# EAGLE design M105 (EAGLE 6.6.0)
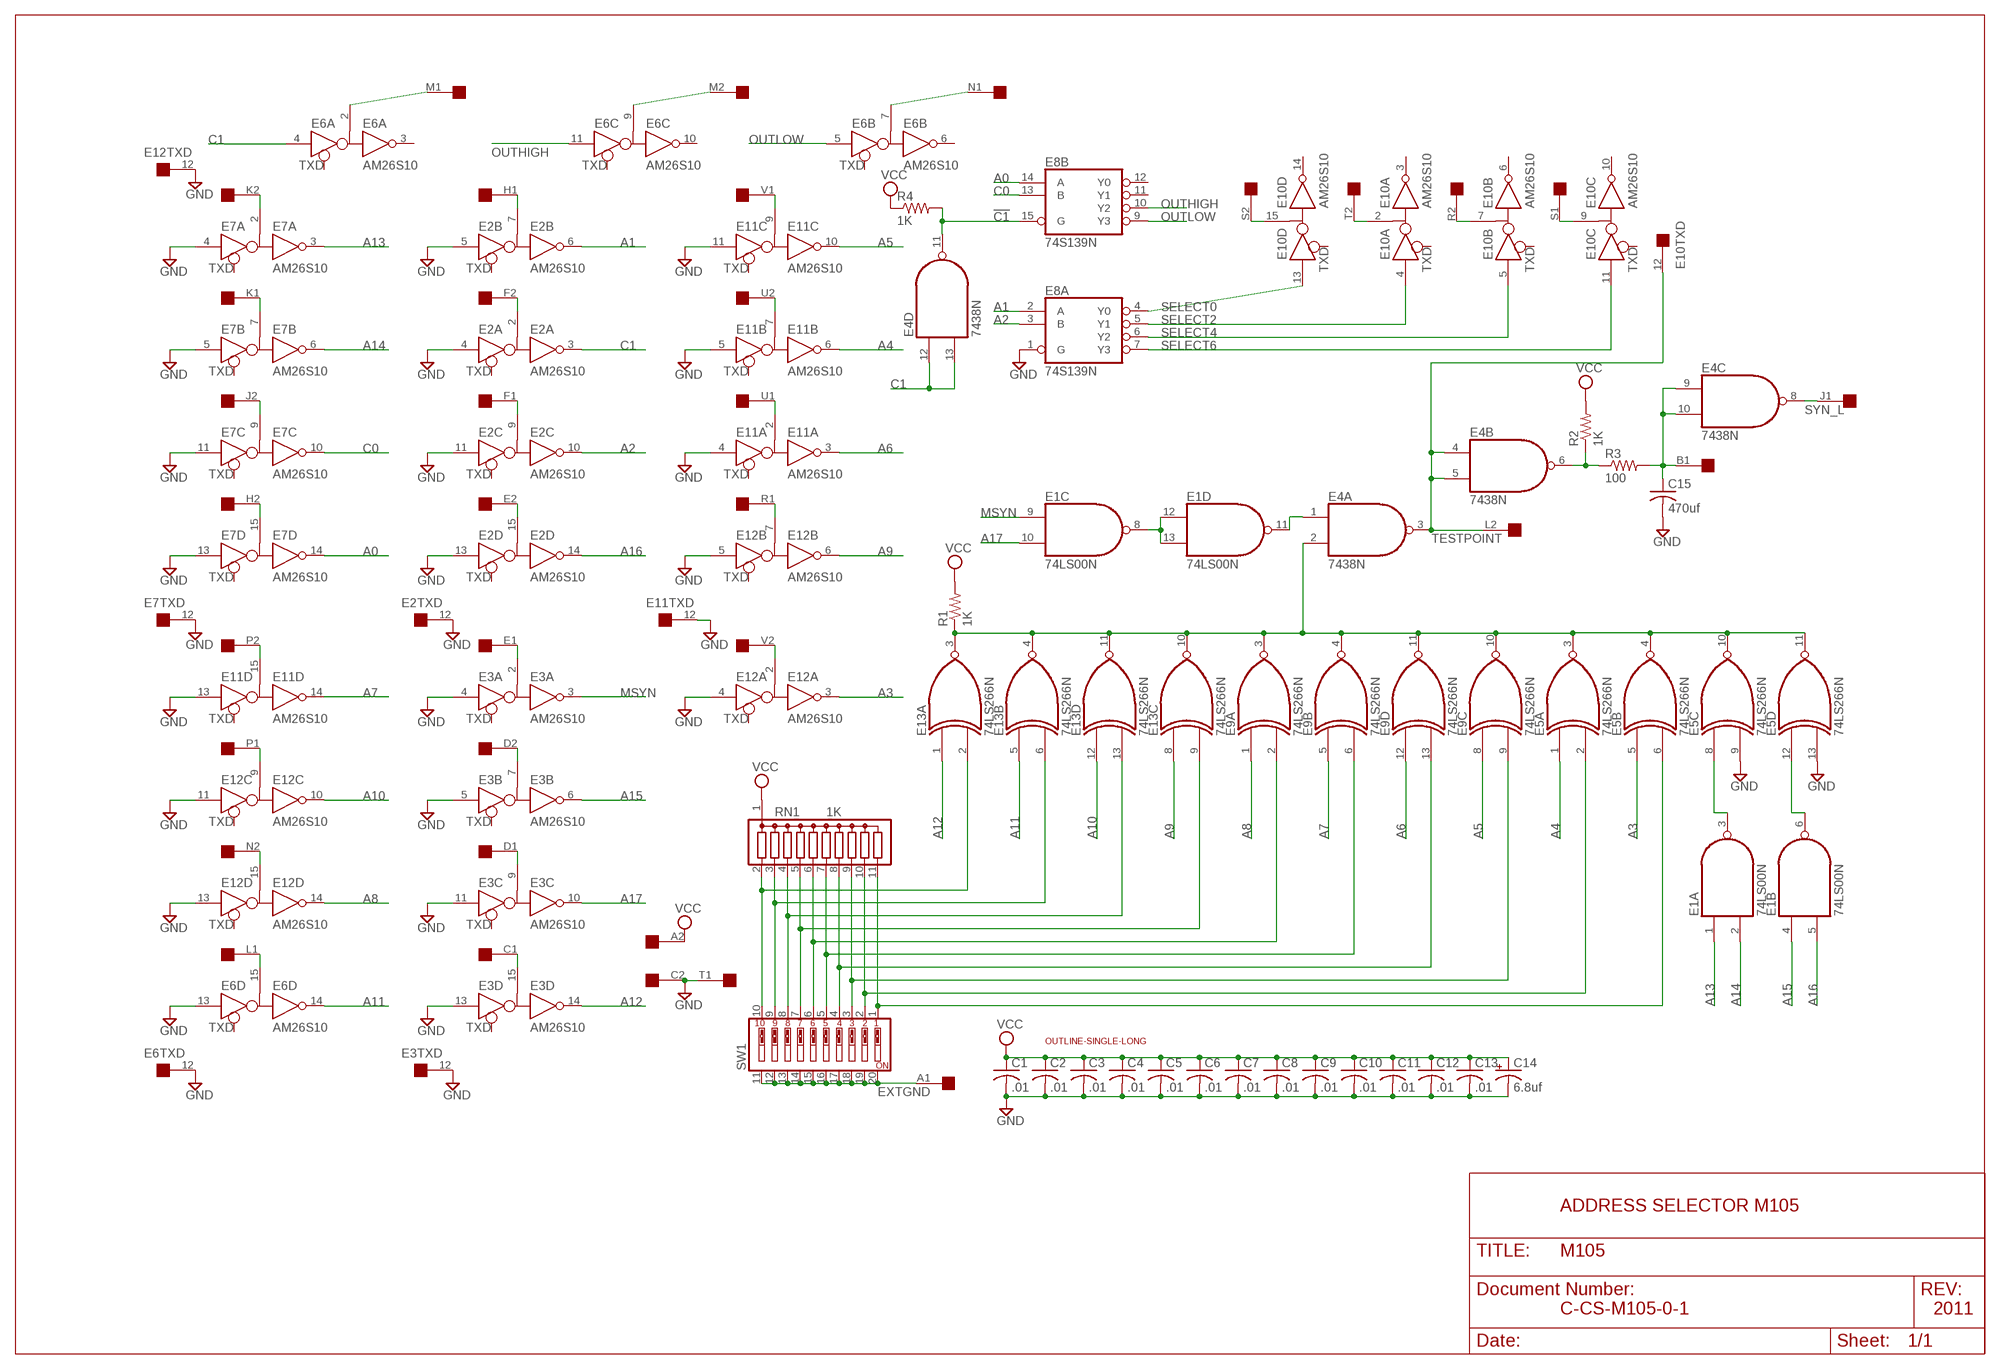
[diagram p0: schematic, sheet 1]

## Parts
C1  .01  C-US050-025X075  [C050-025X075]
C2  .01  C-US050-025X075  [C050-025X075]
C3  .01  C-US050-025X075  [C050-025X075]
C4  .01  C-US050-025X075  [C050-025X075]
C5  .01  C-US050-025X075  [C050-025X075]
C6  .01  C-US050-025X075  [C050-025X075]
C7  .01  C-US050-025X075  [C050-025X075]
C8  .01  C-US050-025X075  [C050-025X075]
C9  .01  C-US050-025X075  [C050-025X075]
C10  .01  C-US050-025X075  [C050-025X075]
C11  .01  C-US050-025X075  [C050-025X075]
C12  .01  C-US050-025X075  [C050-025X075]
C13  .01  C-US050-025X075  [C050-025X075]
C14  6.8uf  CPOL-USE15-5AXIAL  [E15-5]
C15  470uf  C-US050-025X075  [C050-025X075]
E1  74LS00N  [DIL14]
E2  AM26S10  [DIL16]
E3  AM26S10  [DIL16]
E4  7438N  [DIL14]
E5  74LS266N  [DIL14]
E6  AM26S10  [DIL16]
E7  AM26S10  [DIL16]
E8  74S139N  [DIL16]
E9  74LS266N  [DIL14]
E10  AM26S10  [DIL16]
E11  AM26S10  [DIL16]
E12  AM26S10  [DIL16]
E13  74LS266N  [DIL14]
R1  1K  R-US_0207/10  [0207/10]
R2  1K  R-US_0207/10  [0207/10]
R3  100  R-US_0207/10  [0207/10]
R4  1K  R-US_0207/10  [0207/10]
RN1  1K  G10R  [SIL11]
SW1  SW_DIP-10  [EDG-10]
U$1  SINGLE  [EDGE-CON2]
U$2  OUTLINE-SINGLE-LONG  [SINGLE-LONG]

## Nets
!C1: E4.11(D:O) E8.15(B:G) R4.2
A0: E7.14(D:R) E8.14(B:A)
A1: E2.6(B:R) E8.2(A:A)
A2: E2.10(C:R) E8.3(A:B)
A3: E5.5(B:I0) E12.3(A:R)
A4: E5.1(A:I0) E11.6(B:R)
A5: E9.8(C:I0) E11.10(C:R)
A6: E9.12(D:I0) E11.3(A:R)
A7: E9.5(B:I0) E11.14(D:R)
A8: E9.1(A:I0) E12.14(D:R)
A9: E12.6(B:R) E13.8(C:I0)
A10: E12.10(C:R) E13.12(D:I0)
A11: E6.14(D:R) E13.5(B:I0)
A12: E3.14(D:R) E13.1(A:I0)
A13: E1.1(A:I0) E7.3(A:R)
A14: E1.2(A:I1) E7.6(B:R)
A15: E1.4(B:I0) E3.6(B:R)
A16: E1.5(B:I1) E2.14(D:R)
A17: E1.10(C:I1) E3.10(C:R)
C0: E7.10(C:R) E8.13(B:B)
C1: E2.3(A:R) E4.12(D:I0) E4.13(D:I1) E6.4(A:D)
EXTGND: SW1.11 SW1.12 SW1.13 SW1.14 SW1.15 SW1.16 SW1.17 SW1.18 SW1.19 SW1.20 U$1.A1
GND [Supply]: C1.2 C2.2 C3.2 C4.2 C5.2 C6.2 C7.2 C8.2 C9.2 C10.2 C11.2 C12.2 C13.2 C14.- C15.2 E2.4(A:D) E2.5(B:D) E2.11(C:D) E2.12(TXD:TXD) E2.13(D:D) E3.4(A:D) E3.5(B:D) E3.11(C:D) E3.12(TXD:TXD) E3.13(D:D) E5.9(C:I1) E5.13(D:I1) E6.12(TXD:TXD) E6.13(D:D) E7.4(A:D) E7.5(B:D) E7.11(C:D) E7.12(TXD:TXD) E7.13(D:D) E8.1(A:G) E11.4(A:D) E11.5(B:D) E11.11(C:D) E11.12(TXD:TXD) E11.13(D:D) E12.4(A:D) E12.5(B:D) E12.11(C:D) E12.12(TXD:TXD) E12.13(D:D) U$1.C2 U$1.T1
MSYN: E1.9(C:I0) E3.3(A:R)
N$1: E3.2(A:B) U$1.E1
N$2: E3.7(B:B) U$1.D2
N$3: E3.9(C:B) U$1.D1
N$4: E3.15(D:B) U$1.C1
N$5: E2.7(B:B) U$1.H1
N$6: E2.2(A:B) U$1.F2
N$7: E2.9(C:B) U$1.F1
N$8: E2.15(D:B) U$1.E2
N$9: E7.2(A:B) U$1.K2
N$10: E7.7(B:B) U$1.K1
N$11: E7.9(C:B) U$1.J2
N$12: E7.15(D:B) U$1.H2
N$13: E11.15(D:B) U$1.P2
N$14: E12.9(C:B) U$1.P1
N$15: E12.15(D:B) U$1.N2
N$16: E6.15(D:B) U$1.L1
N$17: E12.7(B:B) U$1.R1
N$18: E12.2(A:B) U$1.V2
N$19: E11.2(A:B) U$1.U1
N$20: E11.7(B:B) U$1.U2
N$21: E11.9(C:B) U$1.V1
N$22: E4.6(B:O) R2.1 R3.1
N$23: E10.15(D:B) U$1.S2
N$24: E10.2(A:B) U$1.T2
N$25: E10.7(B:B) U$1.R2
N$26: E10.9(C:B) U$1.S1
N$27: E6.2(A:B) U$1.M1
N$28: E6.9(C:B) U$1.M2
N$29: E1.3(A:O) E5.8(C:I0)
N$30: E1.6(B:O) E5.12(D:I0)
N$31: E1.8(C:O) E1.12(D:I0) E1.13(D:I1)
N$33: E5.6(B:I1) RN1.11 SW1.1
N$34: E5.2(A:I1) RN1.10 SW1.2
N$35: E9.9(C:I1) RN1.9 SW1.3
N$36: E9.13(D:I1) RN1.8 SW1.4
N$37: E9.6(B:I1) RN1.7 SW1.5
N$38: E9.2(A:I1) RN1.6 SW1.6
N$39: E13.9(C:I1) RN1.5 SW1.7
N$40: E13.13(D:I1) RN1.4 SW1.8
N$41: E13.6(B:I1) RN1.3 SW1.9
N$42: E13.2(A:I1) RN1.2 SW1.10
N$43: E4.2(A:I1) E5.3(A:O) E5.4(B:O) E5.10(C:O) E5.11(D:O) E9.3(A:O) E9.4(B:O) E9.10(C:O) E9.11(D:O) E13.3(A:O) E13.4(B:O) E13.10(C:O) E13.11(D:O) R1.1
N$44: C15.1 E4.9(C:I0) E4.10(C:I1) R3.2 U$1.B1
N$45: E6.7(B:B) U$1.N1
N$46: E1.11(D:O) E4.1(A:I0)
OUTHIGH: E6.11(C:D) E8.10(B:Y2)
OUTLOW: E6.5(B:D) E8.9(B:Y3)
SELECT0: E8.4(A:Y0) E10.13(D:D)
SELECT2: E8.5(A:Y1) E10.4(A:D)
SELECT4: E8.6(A:Y2) E10.5(B:D)
SELECT6: E8.7(A:Y3) E10.11(C:D)
SYN_L: E4.8(C:O) U$1.J1
TESTPOINT: E4.3(A:O) E4.4(B:I0) E4.5(B:I1) E10.12(TXD:TXD) U$1.L2
VCC [Supply]: C1.1 C2.1 C3.1 C4.1 C5.1 C6.1 C7.1 C8.1 C9.1 C10.1 C11.1 C12.1 C13.1 C14.+ R1.2 R2.2 R4.1 RN1.1 U$1.A2
Unconnected: E6.3(A:R) E6.6(B:R) E6.10(C:R) E8.11(B:Y1) E8.12(B:Y0) E10.3(A:R) E10.6(B:R) E10.10(C:R) E10.14(D:R) U$1.B2

## Notes on the sheet
- ADDRESS SELECTOR M105
- C-CS-M105-0-1 | 2011

## Power pins joined to a net without a drawn wire
GND: E1.7(P:GND) E2.1(GND:GND) E2.8(PWR:GND) E3.1(GND:GND) E3.8(PWR:GND) E4.7(P:GND) E5.7(P:GND) E6.1(GND:GND) E6.8(PWR:GND) E7.1(GND:GND) E7.8(PWR:GND) E8.8(P:GND) E9.7(P:GND) E10.1(GND:GND) E10.8(PWR:GND) E11.1(GND:GND) E11.8(PWR:GND) E12.1(GND:GND) E12.8(PWR:GND) E13.7(P:GND)
VCC: E1.14(P:VCC) E2.16(PWR:VCC) E3.16(PWR:VCC) E4.14(P:VCC) E5.14(P:VCC) E6.16(PWR:VCC) E7.16(PWR:VCC) E8.16(P:VCC) E9.14(P:VCC) E10.16(PWR:VCC) E11.16(PWR:VCC) E12.16(PWR:VCC) E13.14(P:VCC)

## Library data of the parts
C1-C13 C15 = rcl:C-US: CAPACITOR, American symbol
C14 = rcl:CPOL-US: POLARIZED CAPACITOR, American symbol
E1 = 74xx-us:74*00: Quad 2-input NAND gate
E2 E3 E6 E7 E10-E12 = dec-con:AM26S10: Bus Transceiver
E4 = dec-con:74*38: Quad 2-input NAND gate, open collector output
E5 E9 E13 = 74xx-us:74*266: Quadruple EXCLUSIVE-NOR (XNOR), open-collector
E8 = 74xx-us:74*139: Dual 2-line to 4-line DECODER/DEMULTIPLEXER
R1-R4 = rcl:R-US_: RESISTOR, American symbol
RN1 = resistor-sil:G10R: SIL RESISTOR; OC_FARNELL: unknown; OC_NEWARK: unknown
SW1 = special:SW_DIP-10: DIP SWITCH
U$1 = dec-con:SINGLE: Single-Height DEC board
U$2 = dec-con:OUTLINE-*: Board outlines for DEC boards.

## Net classes
1 Supply: width 0.813 mm

## Board
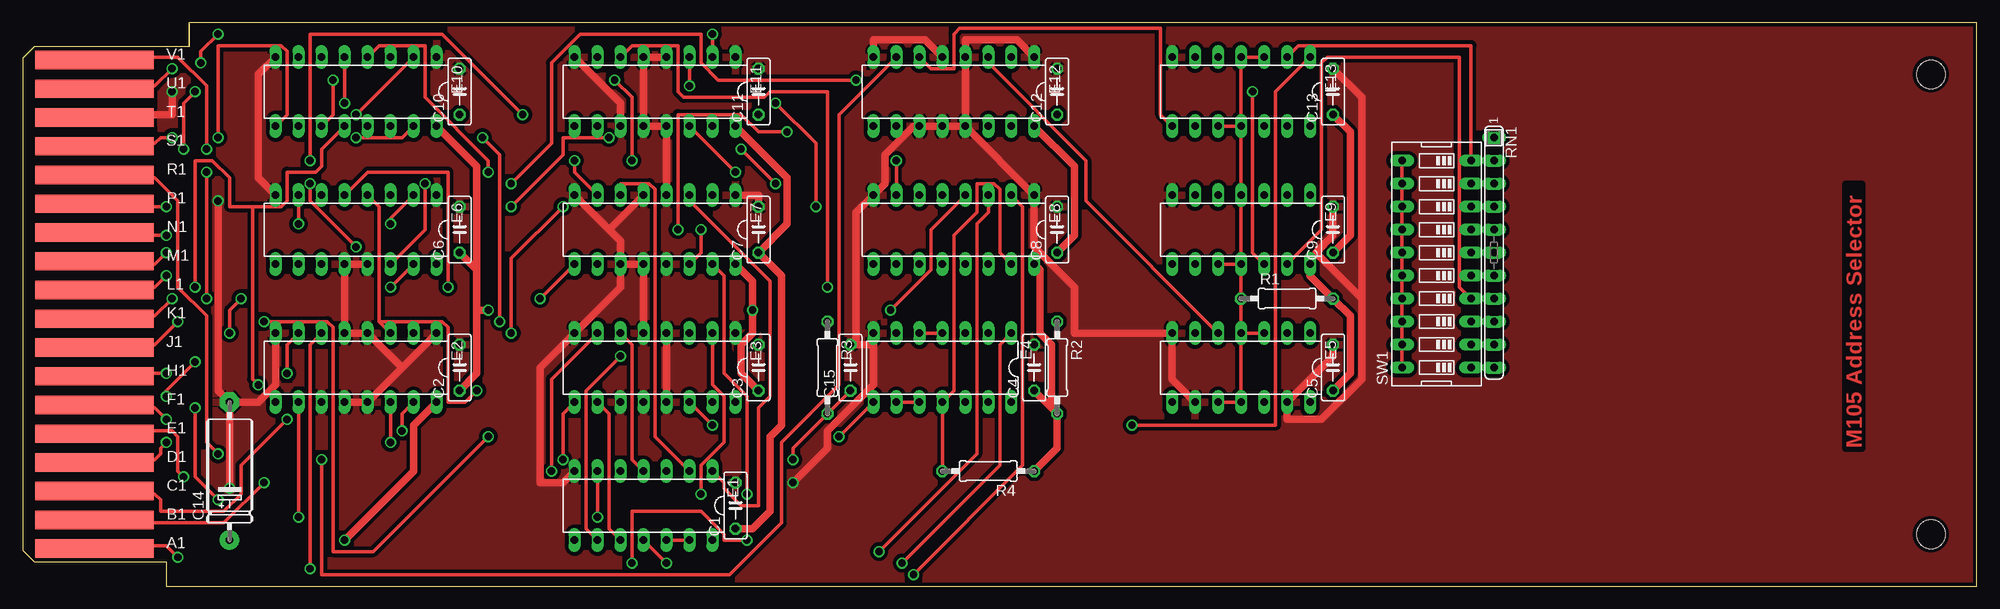
[diagram p1: board, top side]
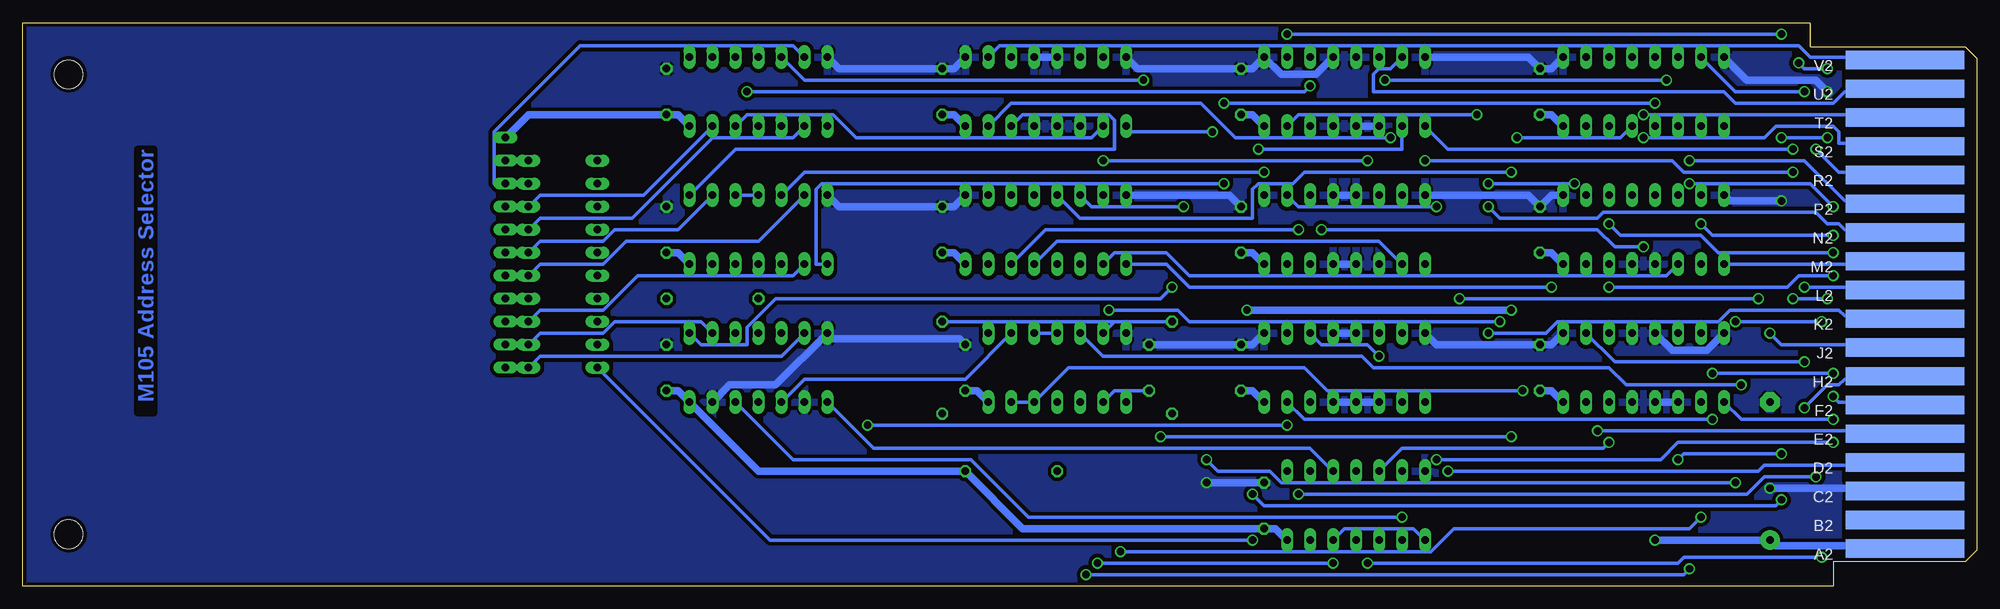
[diagram p2: board, bottom side, seen from below]

Size 215.9 x 62.23 mm. Coordinates in mm from the lower left corner, seen from the top.
Copper layers (1+16): Top 0.035mm / dielectric 1.5mm / Bottom 0.035mm
Design rules "16mils": minimum track width 16mil, minimum drill 32mil, track to track 15mil, track to pad 10mil, pad to pad 10mil, via to via 10mil, smd to smd 10mil, copper to edge 13mil, drill to drill 10mil, minimum pad ring 10mil, minimum via ring 8mil, stop-mask expansion 0mil, vias tented up to drill 0mil, thermal gap 10mil

### Footprints (pad centres in the part's own frame; a part is rotated, then mirrored left to right if it is on the bottom)
C050-025X075 = drill 0.813 octagon: 1 -2.54,0; 2 2.54,0
E15-5 = drill 0.813 pad 2.159: + -7.62,0 | drill 0.813 pad 2.159 octagon: - 7.62,0
DIL14 = drill 0.813 long: 1 -7.62,-3.81; 2 -5.08,-3.81; 3 -2.54,-3.81; 4 0,-3.81; 5 2.54,-3.81; 6 5.08,-3.81; 7 7.62,-3.81; 8 7.62,3.81; 9 5.08,3.81; 10 2.54,3.81; 11 0,3.81; 12 -2.54,3.81; 13 -5.08,3.81; 14 -7.62,3.81
DIL16 = drill 0.813 long: 1 -8.89,-3.81; 2 -6.35,-3.81; 3 -3.81,-3.81; 4 -1.27,-3.81; 5 1.27,-3.81; 6 3.81,-3.81; 7 6.35,-3.81; 8 8.89,-3.81; 9 8.89,3.81; 10 6.35,3.81; 11 3.81,3.81; 12 1.27,3.81; 13 -1.27,3.81; 14 -3.81,3.81; 15 -6.35,3.81; 16 -8.89,3.81
0207/10 = drill 0.813 octagon: 1 -5.08,0; 2 5.08,0
SIL11 = drill 0.813 long: 1 -12.7,0; 2 -10.16,0; 3 -7.62,0; 4 -5.08,0; 5 -2.54,0; 6 0,0; 7 2.54,0; 8 5.08,0; 9 7.62,0; 10 10.16,0; 11 12.7,0
EDG-10 = drill 0.813 long: 1 -11.43,-3.81; 2 -8.89,-3.81; 3 -6.35,-3.81; 4 -3.81,-3.81; 5 -1.27,-3.81; 6 1.27,-3.81; 7 3.81,-3.81; 8 6.35,-3.81; 9 8.89,-3.81; 10 11.43,-3.81; 11 11.43,3.81; 12 8.89,3.81; 13 6.35,3.81; 14 3.81,3.81; 15 1.27,3.81; 16 -1.27,3.81; 17 -3.81,3.81; 18 -6.35,3.81; 19 -8.89,3.81; 20 -11.43,3.81
EDGE-CON2 = smd 13.106 x 2.032: A1 7.938,4.128; B1 7.938,7.303; C1 7.938,10.477; D1 7.938,13.652; E1 7.938,16.828; F1 7.938,20.003; H1 7.938,23.177; J1 7.938,26.352; K1 7.938,29.527; L1 7.938,32.703; M1 7.938,35.877; N1 7.938,39.053; P1 7.938,42.227; R1 7.938,45.403; S1 7.938,48.578; T1 7.938,51.752; U1 7.938,54.928; V1 7.938,58.102 | smd 13.106 x 2.032 bottom: A2 7.938,4.128; B2 7.938,7.303; C2 7.938,10.477; D2 7.938,13.652; E2 7.938,16.828; F2 7.938,20.003; H2 7.938,23.177; J2 7.938,26.352; K2 7.938,29.527; L2 7.938,32.703; M2 7.938,35.877; N2 7.938,39.053; P2 7.938,42.227; R2 7.938,45.403; S2 7.938,48.578; T2 7.938,51.752; U2 7.938,54.928; V2 7.938,58.102
SINGLE-LONG = hole 3.175: 210.82,56.515; 210.82,5.715

### Placement (x,y rotation side)
C1  78.74,8.89 90 top
C2  48.26,24.13 90 top
C3  81.28,24.13 90 top
C4  111.76,24.13 90 top
C5  144.78,24.13 90 top
C6  48.26,39.37 90 top
C7  81.28,39.37 90 top
C8  114.3,39.37 90 top
C9  144.78,39.37 90 top
C10  48.26,54.61 90 top
C11  81.28,54.61 90 top
C12  114.3,54.61 90 top
C13  144.78,54.61 90 top
C14  22.86,12.7 90 top
C15  91.44,24.13 90 top
E1  68.58,8.89 180 top
E2  36.83,24.13 180 top
E3  69.85,24.13 180 top
E4  101.6,24.13 180 top
E5  134.62,24.13 180 top
E6  36.83,39.37 180 top
E7  69.85,39.37 180 top
E8  102.87,39.37 180 top
E9  134.62,39.37 180 top
E10  36.83,54.61 180 top
E11  69.85,54.61 180 top
E12  102.87,54.61 180 top
E13  134.62,54.61 180 top
R1  139.7,31.75 0 top
R2  114.3,24.13 270 top
R3  88.9,24.13 270 top
R4  106.68,12.7 180 top
RN1  162.56,36.83 270 top
SW1  156.21,35.56 90 top
U$1  0,0 0 top
U$2  0,0 0 top

### Tracks (layer width: path | path; a pad name or v marks a point on that pad's centre or on a via)
!C1
  Top 0.406: R4.2 E4.11 102.87,21.59 102.87,38.73 105.41,41.27 105.41,44.45 107.32,44.45 107.95,43.81 107.95,36.83 E8.15
A0  (via drill 0.81)
  Top 0.406: E7.14 74.93,36.83 v74.93,39.37
  Bottom 0.406: v74.93,39.37 102.87,39.37 E8.14
A1  (via drill 0.81)
  Top 0.406: E2.6 31.75,26.67 v31.75,1.91 | v98.43,1.27 110.49,13.34 110.49,41.91 E8.2
  Bottom 0.406: v31.75,1.91 32.39,1.27 v98.43,1.27
A2  (via drill 0.81)
  Top 0.406: v30.48,7.62 E2.10 | v94.62,3.81 105.41,14.61 105.41,40.01 106.68,41.27 E8.3
  Bottom 0.406: v30.48,7.62 31.75,6.35 57.79,6.35 60.33,3.81 v94.62,3.81
A3
  Top 0.406: E5.5 117.48,42.55 117.48,46.99 106.68,57.78 E12.3
A4  (via drill 0.81)
  Top 0.406: E11.6 67.31,59.69 72.39,59.69 72.39,54.61 73.03,53.98 81.92,53.98 82.55,54.61 88.9,54.61 v88.9,33.02
  Bottom 0.406: v88.9,33.02 90.17,31.75 132.72,31.75 135.89,28.57 135.89,26.67 140.97,26.67 E5.1
A5  (via drill 0.81)
  Top 0.406: v83.19,44.45 v79.38,48.26
  Bottom 0.406: E11.10 63.5,48.26 v79.38,48.26 | v83.19,44.45 127.64,44.45 128.27,43.81 128.27,35.56 E9.8
A6  (via drill 0.81)
  Top 0.406: v73.66,55.24 E11.3 | v135.89,54.61 135.89,36.83 E9.12
  Bottom 0.406: v73.66,55.24 74.3,54.61 v135.89,54.61
A7  (via drill 0.81)
  Top 0.406: v78.74,45.72 E11.14
  Bottom 0.406: v78.74,45.72 129.54,45.72 E9.5
A8
  Bottom 0.406: E12.14 105.41,52.07 95.89,52.07 95.25,51.44 95.25,48.26 137.16,48.26 E9.1
A9
  Top 0.406: E12.6 100.33,57.15 102.87,57.15 102.87,60.96 103.51,61.59 125.73,61.59 125.73,52.07 E13.8
A10
  Bottom 0.406: E12.10 97.79,49.53 123.83,49.53 126.37,52.07 135.89,52.07 E13.12
A11  (via drill 0.81)
  Top 0.406: E6.14 44.45,39.37 v44.45,44.45 | v53.98,44.45 58.42,48.9 58.42,57.78 61.6,60.96 74.93,60.96 74.93,57.78 76.84,55.88 v92.08,55.88
  Bottom 0.406: v53.98,44.45 v44.45,44.45 | v92.08,55.88 129.54,55.88 E13.5
A12  (via drill 0.81)
  Top 0.406: v76.2,17.78 E3.14 | v122.56,17.78 138.43,17.78 138.43,54.61 E13.1
  Bottom 0.406: v122.56,17.78 v76.2,17.78
A13
  Top 0.406: E1.1 77.47,11.43 77.47,10.79 79.38,8.89 81.28,8.89 81.28,19.68 82.55,20.95 82.55,33.66 73.66,42.55 E7.3
A14
  Top 0.406: E1.2 69.85,16.51 69.85,43.81 69.22,44.45 66.04,44.45 E7.6
A15
  Top 0.406: E1.4 67.31,13.97 67.31,26.67 E3.6
A16  (via drill 0.81)
  Top 0.406: v40.64,15.88 E2.14
  Bottom 0.406: v40.64,15.88 41.28,15.24 63.5,15.24 E1.5
A17
  Top 0.406: E1.10 64.77,6.35 64.77,19.05 E3.10
C0
  Bottom 0.406: E7.10 66.04,38.1 101.6,38.1 E8.13
C1  (via drill 0.81)
  Top 0.406: 39.37,29.21 E2.3 | 39.37,29.21 39.37,41.91 E6.4 | v50.17,21.59 48.9,20.32 46.99,20.32 46.99,28.57 46.36,29.21 39.37,29.21
  Bottom 0.406: E4.13 E4.12 100.33,24.13 74.3,24.13 71.76,21.59 v50.17,21.59
EXTGND  (via drill 0.81)
  Top 0.406: SW1.11 SW1.12 SW1.13 SW1.14 SW1.15 SW1.16 SW1.17 SW1.18 SW1.19 SW1.20 | v80.01,5.08 77.47,5.08 77.47,5.71 74.93,8.26 67.31,8.26 v67.31,2.54 | v17.15,3.17 15.88,4.45 8.26,4.45 U$1.A1
  Bottom 0.406: SW1.20 133.35,5.08 v80.01,5.08 | v67.31,2.54 33.02,2.54 32.39,3.17 v17.15,3.17
GND  (via drill 0.81)
  Top 0.813: E2.12 E2.13 41.91,24.13 | 41.91,24.13 E2.1 | E6.8 26.04,45.09 26.04,56.52 E10.8 | E6.13 E6.12 E2.5 E2.4 41.91,24.13 | C14.- 26.04,20.32 27.94,22.23 E2.8 | v21.59,42.55 21.59,21.59 C14.- | C14.- v22.86,10.79 | v16.51,54.61 16.51,52.07 8.26,52.07 U$1.T1 | E5.9 127,22.86 E5.7 116.21,27.94 116.21,33.02 111.76,37.47 E8.1 E12.13 | C5.2 144.78,25.4 E5.13 139.7,18.41 143.51,18.41 147.96,22.86 147.96,31.75 | C9.2 144.78,38.73 142.88,36.83 147.96,31.75 | C13.2 147.96,53.98 147.96,31.75 | E1.7 59.69,11.43 57.15,11.43 57.15,24.13 E3.8 66.04,33.02 E7.11 | E7.11 E7.12 E3.5 | 64.77,39.37 66.04,38.1 E7.11 | 64.77,39.37 E7.8 | 64.77,39.37 E7.5 | E3.4 E3.13 | E7.1 81.28,43.18 C7.2 | v85.09,11.43 88.9,15.24 88.9,17.14 93.98,22.23 93.98,26.67 | E4.7 93.98,26.67 | 93.98,26.67 92.08,26.67 | 92.08,26.67 92.08,41.27 E8.8 95.25,44.45 95.25,47.62 98.43,50.8 E12.11 E12.12 E12.13 | 92.08,26.67 C15.2 | E12.13 E12.4 104.14,60.33 109.86,60.33 E12.1 | E11.4 E11.5 E11.12 E11.13 E7.4 | E11.8 66.04,53.34 E11.11 | E12.5 99.7,60.33 93.98,60.33 E12.8
  Bottom 0.813: E2.1 46.99,26.67 C2.2 59.69,26.67 E3.8 | E2.12 E2.11 | E2.8 29.85,26.04 33.66,26.04 E2.5 | E6.8 27.31,42.55 v21.59,42.55 | v22.86,10.79 8.26,10.79 U$1.C2 | v16.51,54.61 17.78,55.88 25.4,55.88 E10.8 | C4.2 112.4,27.3 126.37,27.3 E5.7 132.72,22.23 137.8,22.23 E5.13 | E3.11 E3.12 E3.13 | E6.1 46.99,43.18 C6.2 49.53,43.18 E7.8 | E7.4 E7.5 | E3.4 E3.5 | E7.12 E7.13 | E3.1 80.01,26.67 C3.2 C15.2 | v85.09,11.43 C1.2 | C7.2 82.55,43.18 E8.8 | E12.1 113.03,57.15 C12.2 125.73,57.15 E13.7 | E12.4 E12.5 | E8.1 113.03,41.91 C8.2 125.73,41.91 E9.7 | E12.8 92.71,57.15 C11.2 80.01,57.15 E11.1 76.84,56.52 73.03,56.52 E11.4 | E10.1 46.99,57.15 C10.2 49.53,58.42 E11.8 | E11.12 E11.11
  pour Bottom (isolate 0.406): 15.24,0 215.9,0 215.9,62.23 15.24,62.23
  pour Top (isolate 0.406): 15.24,0 215.9,0 215.9,62.23 15.24,62.23
MSYN  (via drill 0.81)
  Top 0.406: E1.9 62.23,6.35 62.23,21.59 v66.04,25.4
  Bottom 0.406: v66.04,25.4 67.31,26.67 72.39,26.67 E3.3
N$1  (via drill 0.81)
  Top 0.406: E3.2 76.2,22.23 77.47,20.95 77.47,15.88 74.93,13.34 v74.93,10.16 | v17.78,12.06 17.15,12.7 17.15,16.51 16.51,17.14 8.26,17.14 U$1.E1
  Bottom 0.406: v74.93,10.16 25.4,10.16 23.5,12.06 v17.78,12.06
N$2  (via drill 0.81)
  Top 0.406: E3.7 58.42,22.86 v58.42,12.7
  Bottom 0.406: v58.42,12.7 24.13,12.7 23.5,13.34 8.26,13.34 U$1.D2
N$3  (via drill 0.81)
  Top 0.406: E3.9 59.69,19.05 v59.69,13.97 | v15.88,15.88 15.24,15.24 15.24,14.61 14.61,13.97 8.26,13.97 U$1.D1
  Bottom 0.406: v59.69,13.97 34.93,13.97 33.02,15.88 v15.88,15.88
N$4  (via drill 0.81)
  Top 0.406: v29.21,18.41 24.13,13.34 24.13,10.16 22.23,8.26 15.24,8.26 15.24,9.53 14.61,10.16 8.26,10.16 U$1.C1
  Bottom 0.406: E3.15 74.3,18.41 v29.21,18.41
N$5  (via drill 0.81)
  Top 0.406: E2.7 29.21,26.67 v29.21,23.5 | v15.88,23.5 8.26,23.5 U$1.H1
  Bottom 0.406: v15.88,23.5 v29.21,23.5
N$6  (via drill 0.81)
  Top 0.406: v19.05,24.77 15.88,21.59 v15.88,20.95
  Bottom 0.406: E2.2 40.01,24.77 v19.05,24.77 | v15.88,20.95 15.24,20.32 8.26,20.32 U$1.F2
N$7  (via drill 0.81)
  Top 0.406: v15.88,18.41 14.61,19.68 8.26,19.68 U$1.F1
  Bottom 0.406: E2.9 26.04,18.41 v15.88,18.41
N$8  (via drill 0.81)
  Top 0.406: E2.15 41.91,19.05 v41.91,17.14
  Bottom 0.406: v41.91,17.14 8.26,17.14 U$1.E2
N$9  (via drill 0.81)
  Top 0.406: v59.69,41.91 53.98,36.2 v53.98,27.94
  Bottom 0.406: E7.2 74.93,41.91 v59.69,41.91 | v53.98,27.94 47.63,27.94 46.36,29.21 28.58,29.21 27.31,30.48 15.24,30.48 14.61,29.84 8.26,29.84 U$1.K2
N$10  (via drill 0.81)
  Top 0.406: E7.7 60.96,45.72 v60.96,46.99 | v20.32,31.75 v20.32,45.72 | v16.51,31.75 14.61,29.84 8.26,29.84 U$1.K1
  Bottom 0.406: v60.96,46.99 33.66,46.99 32.39,45.72 v20.32,45.72 | v16.51,31.75 v20.32,31.75
N$11  (via drill 0.81)
  Top 0.406: v57.15,31.75 E7.9 | v24.13,31.75 22.86,30.48 v22.86,27.94
  Bottom 0.406: v24.13,31.75 v57.15,31.75 | v22.86,27.94 21.59,26.67 8.26,26.67 U$1.J2
N$12  (via drill 0.81)
  Top 0.406: E7.15 77.47,34.29 77.47,23.5 80.01,20.95 v80.01,10.16 | v21.59,9.53 19.05,12.06 v19.05,19.68
  Bottom 0.406: v80.01,10.16 78.74,8.89 22.23,8.89 v21.59,9.53 | v19.05,19.68 16.51,22.23 15.24,22.23 14.61,22.86 8.26,22.86 U$1.H2
N$13  (via drill 0.81)
  Top 0.406: v55.25,52.07 46.36,60.96 31.75,60.96 v31.75,46.99
  Bottom 0.406: E11.15 74.93,52.07 v55.25,52.07 | v31.75,46.99 19.05,46.99 14.61,42.55 8.26,42.55 U$1.P2
N$14  (via drill 0.81)
  Top 0.406: v84.46,50.16 81.28,50.16 79.38,52.07 72.39,52.07 v72.39,39.37 | v36.83,37.47 31.75,42.55 v31.75,44.45 | v15.88,41.91 8.26,41.91 U$1.P1
  Bottom 0.406: E12.9 93.35,50.16 v84.46,50.16 | v72.39,39.37 41.91,39.37 40.01,37.47 v36.83,37.47 | v31.75,44.45 18.42,44.45 v15.88,41.91
N$15  (via drill 0.81)
  Top 0.406: v64.77,49.53 59.69,49.53 59.69,47.62 v53.98,41.91
  Bottom 0.406: E12.15 106.68,53.34 85.73,53.34 81.92,49.53 v64.77,49.53 | v53.98,41.91 52.71,40.64 41.91,40.64 41.28,41.27 17.78,41.27 16.51,40.01 15.24,40.01 14.61,39.37 8.26,39.37 U$1.N2
N$16  (via drill 0.81)
  Top 0.406: v40.64,33.02 E6.15 | v15.88,34.29 14.61,33.02 8.26,33.02 U$1.L1
  Bottom 0.406: v40.64,33.02 20.96,33.02 19.69,34.29 v15.88,34.29
N$17  (via drill 0.81)
  Top 0.406: E12.7 90.17,52.07 90.17,22.23 83.82,15.88 83.82,6.99 78.11,1.27 33.02,1.27 v33.02,13.97 | v21.59,14.61 20.32,15.88 20.32,29.84 17.15,33.02 17.15,42.55 14.61,45.09 8.26,45.09 U$1.R1
  Bottom 0.406: v33.02,13.97 32.39,14.61 v21.59,14.61
N$18
  Bottom 0.406: E12.2 107.95,59.69 19.69,59.69 18.42,58.42 8.26,58.42 U$1.V2
N$19  (via drill 0.81)
  Top 0.406: v76.2,60.96 E11.2 | v21.59,60.96 19.69,59.05 v19.69,57.78 | v16.51,57.15 14.61,55.24 8.26,55.24 U$1.U1
  Bottom 0.406: v21.59,60.96 v76.2,60.96 | v19.69,57.78 19.05,57.15 v16.51,57.15
N$20
  Bottom 0.406: E11.7 64.77,57.15 66.04,57.15 66.68,56.52 66.68,54.61 27.94,54.61 26.67,53.34 15.88,53.34 14.61,54.61 8.26,54.61 U$1.U2
N$21  (via drill 0.81)
  Top 0.406: v20.32,48.26 20.32,55.24 17.15,58.42 8.26,58.42 U$1.V1
  Bottom 0.406: E11.9 58.42,48.26 v20.32,48.26
N$22
  Bottom 0.406: 95.25,29.21 E4.6 | R3.1 95.25,29.21 | 95.25,29.21 R2.1
N$23  (via drill 0.81)
  Top 0.406: E10.15 41.91,49.53 v36.83,49.53
  Bottom 0.406: v36.83,49.53 23.5,49.53 22.23,50.8 15.88,50.8 15.24,50.16 15.24,48.9 8.26,48.9 U$1.S2
N$24  (via drill 0.81)
  Top 0.406: v36.83,52.07 E10.2
  Bottom 0.406: v36.83,52.07 8.26,52.07 U$1.T2
N$25  (via drill 0.81)
  Top 0.406: v19.05,54.61 17.78,53.34 v17.78,48.26
  Bottom 0.406: E10.7 26.67,54.61 v19.05,54.61 | v17.78,48.26 15.24,45.72 8.26,45.72 U$1.R2
N$26  (via drill 0.81)
  Top 0.406: E10.9 29.21,52.07 29.21,59.05 28.58,59.69 21.59,59.69 v21.59,49.53 | v16.51,49.53 15.24,49.53 14.61,48.9 8.26,48.9 U$1.S1
  Bottom 0.406: v16.51,49.53 v21.59,49.53
N$27  (via drill 0.81)
  Top 0.406: E6.2 40.64,40.64 v40.64,40.01 | v15.88,36.83 14.61,35.56 8.26,35.56 U$1.M1
  Bottom 0.406: v40.64,40.01 39.37,38.73 30.48,38.73 28.58,36.83 v15.88,36.83
N$28
  Bottom 0.406: E6.9 8.26,35.56 U$1.M2
N$29
  Bottom 0.406: E1.3 73.66,15.24 121.92,15.24 E5.8
N$30  (via drill 0.81)
  Top 0.406: v63.5,7.62 E1.6
  Bottom 0.406: v63.5,7.62 104.78,7.62 111.13,13.97 130.81,13.97 E5.12
N$31
  Top 0.406: E1.12 E1.13
  Bottom 0.406: E1.8 62.23,6.35 69.85,6.35 E1.12
N$33
  Top 0.406: RN1.11 SW1.1
  Bottom 0.406: E5.6 132.08,25.4 158.75,25.4 SW1.1
N$34
  Top 0.406: RN1.10 SW1.2
  Bottom 0.406: E5.2 140.97,29.21 150.5,29.21 151.77,27.94 158.75,27.94 SW1.2
N$35
  Top 0.406: RN1.9 SW1.3
  Bottom 0.406: E9.9 130.81,34.29 147.96,34.29 151.77,30.48 158.75,30.48 SW1.3
N$36
  Top 0.406: RN1.8 SW1.4 158.75,33.02 158.75,58.42 144.15,58.42 143.51,57.78 143.51,39.37 E9.13
N$37
  Top 0.406: RN1.7 SW1.5
  Bottom 0.406: E9.6 134.62,38.1 149.23,38.1 151.77,35.56 158.75,35.56 SW1.5
N$38
  Top 0.406: RN1.6 SW1.6
  Bottom 0.406: E9.2 143.51,39.37 150.5,39.37 151.77,38.1 158.75,38.1 SW1.6
N$39
  Top 0.406: RN1.5 SW1.7
  Bottom 0.406: E13.9 130.81,49.53 139.7,49.53 148.59,40.64 158.75,40.64 SW1.7
N$40
  Top 0.406: RN1.4 SW1.8
  Bottom 0.406: E13.13 147.32,43.18 158.75,43.18 SW1.8
N$41
  Top 0.406: RN1.3 SW1.9
  Bottom 0.406: E13.6 130.81,59.69 154.31,59.69 163.83,50.16 163.83,44.45 RN1.3
N$42
  Top 0.406: RN1.2 SW1.10 160.02,59.69 140.97,59.69 E13.2
N$43
  Top 0.406: E13.11 E13.10 | E13.3 E13.4 E13.11 | E13.11 E9.4 E9.11 | E5.3 E5.4 | E9.11 E9.10 | E9.11 R1.1 E5.4 | E5.10 E5.11 E5.4
  Bottom 0.406: E9.3 E9.4 | E4.2 111.76,22.86 129.54,22.86 E5.10
N$44  (via drill 0.81)
  Top 0.406: E4.10 E4.9 | C15.1 R3.2 85.09,15.24 v85.09,13.97 | v26.67,11.43 22.23,6.99 8.26,6.99 U$1.B1
  Bottom 0.406: E4.9 95.25,21.59 C15.1 | v85.09,13.97 83.82,12.7 78.11,12.7 76.84,11.43 v26.67,11.43
N$45  (via drill 0.81)
  Top 0.406: v30.48,40.01 E6.7 | v15.88,38.73 8.26,38.73 U$1.N1
  Bottom 0.406: v30.48,40.01 29.21,38.73 v15.88,38.73
N$46  (via drill 0.81)
  Top 0.406: v71.12,2.54 E1.11 | v97.16,2.54 107.95,13.34 107.95,26.67 E4.1
  Bottom 0.406: v97.16,2.54 v71.12,2.54
OUTHIGH
  Bottom 0.406: E6.11 34.29,34.29 87,34.29 89.54,36.83 95.25,36.83 E8.10
OUTLOW  (via drill 0.81)
  Top 0.406: E6.5 38.1,45.72 46.99,45.72 v46.99,33.02
  Bottom 0.406: v46.99,33.02 87,33.02 89.54,35.56 E8.9
SELECT0  (via drill 0.81)
  Top 0.406: v50.8,49.53 52.71,47.62 v52.71,29.21 | v95.89,30.48 100.33,34.92 100.33,39.37 E8.4
  Bottom 0.406: E10.13 39.37,49.53 v50.8,49.53 | v52.71,29.21 87,29.21 88.27,30.48 v95.89,30.48
SELECT2  (via drill 0.81)
  Top 0.406: E10.4 39.37,59.69 44.45,59.69 44.45,53.98 51.44,46.99 v51.44,45.72
  Bottom 0.406: v51.44,45.72 74.3,45.72 75.57,44.45 79.38,44.45 80.01,43.81 80.01,40.64 99.06,40.64 E8.5
SELECT4  (via drill 0.81)
  Top 0.406: v35.56,53.34 E10.5 | v83.19,53.34 87.63,48.9 v87.63,41.91
  Bottom 0.406: v83.19,53.34 v35.56,53.34 | v87.63,41.91 97.79,41.91 E8.6
SELECT6  (via drill 0.81)
  Top 0.406: E10.11 34.29,52.07 v34.29,55.88 | v65.41,55.88 67.31,53.98 v67.31,46.99 | E8.7 v96.52,46.99
  Bottom 0.406: v65.41,55.88 v34.29,55.88 | v96.52,46.99 v67.31,46.99
SYN_L  (via drill 0.81)
  Top 0.406: v90.17,16.51 E4.8 | v51.44,16.51 38.74,3.81 34.29,3.81 34.29,28.57 33.66,29.21 v26.67,29.21 | v17.15,29.21 14.61,26.67 8.26,26.67 U$1.J1
  Bottom 0.406: v51.44,16.51 v90.17,16.51 | v17.15,29.21 v26.67,29.21
TESTPOINT  (via drill 0.81)
  Top 0.406: E4.4 E4.5 | E10.12 33.02,48.26 33.02,46.35 32.39,45.72 29.21,45.72 29.21,42.55 28.58,41.91 25.4,41.91 | 25.4,41.91 22.86,41.91 22.86,45.09 20.96,46.99 19.05,46.99 v19.05,33.02 | v26.04,22.23 25.4,22.86 25.4,41.91
  Bottom 0.406: E4.4 E4.3 | v19.05,33.02 8.26,33.02 U$1.L2 | E4.5 96.52,25.4 67.95,25.4 66.68,24.13 40.64,24.13 38.74,22.23 v26.04,22.23
VCC  (via drill 0.81)
  Top 0.813: C2.1 50.17,23.5 50.17,30.48 | 50.17,34.92 50.17,30.48 | C6.1 50.17,34.92 | E10.16 50.17,46.35 50.17,34.92 | E2.16 43.18,17.78 43.18,12.7 v35.56,5.08 | E9.14 142.24,34.29 R1.2 146.69,29.84 146.69,23.5 C5.1 | C9.1 146.69,38.73 146.69,50.16 C13.1 | C3.1 79.38,23.5 79.38,26.67 80.65,27.94 v80.65,30.48 80.65,33.66 E7.16 | E11.16 84.46,45.09 84.46,40.01 C7.1 83.82,34.29 83.82,17.78 82.55,16.51 82.55,8.26 80.65,6.35 C1.1 | R4.1 114.3,15.24 R2.2 113.67,19.68 | 113.67,19.68 C4.1 | E8.16 112.4,34.92 112.4,27.94 113.67,26.67 113.67,19.68 | E12.16 116.21,46.35 116.21,38.73 C8.1 | v51.44,30.48 50.17,30.48
  Bottom 0.813: E10.16 46.99,52.07 C10.1 | E2.16 46.99,21.59 C2.1 | E6.16 46.99,36.83 C6.1 | U$1.A2 8.26,4.45 22.23,4.45 C14.+ v35.56,5.08 | C5.1 143.51,21.59 E5.14 134.62,12.7 R4.1 105.41,6.35 C1.1 77.47,6.35 E1.14 | E9.14 143.51,36.83 C9.1 | E13.14 143.51,52.07 C13.1 160.02,52.07 RN1.1 | E11.16 80.01,52.07 C11.1 | E3.16 80.01,21.59 C3.1 | E7.16 80.01,36.83 C7.1 | E12.16 113.03,52.07 C12.1 | E8.16 113.03,36.83 C8.1 | E4.14 110.49,21.59 C4.1 | v80.65,30.48 v51.44,30.48

### Text on the board
Top: M105 Address Selector
Bottom: M105 Address Selector